# Altium project KOSVT.PrjPcb
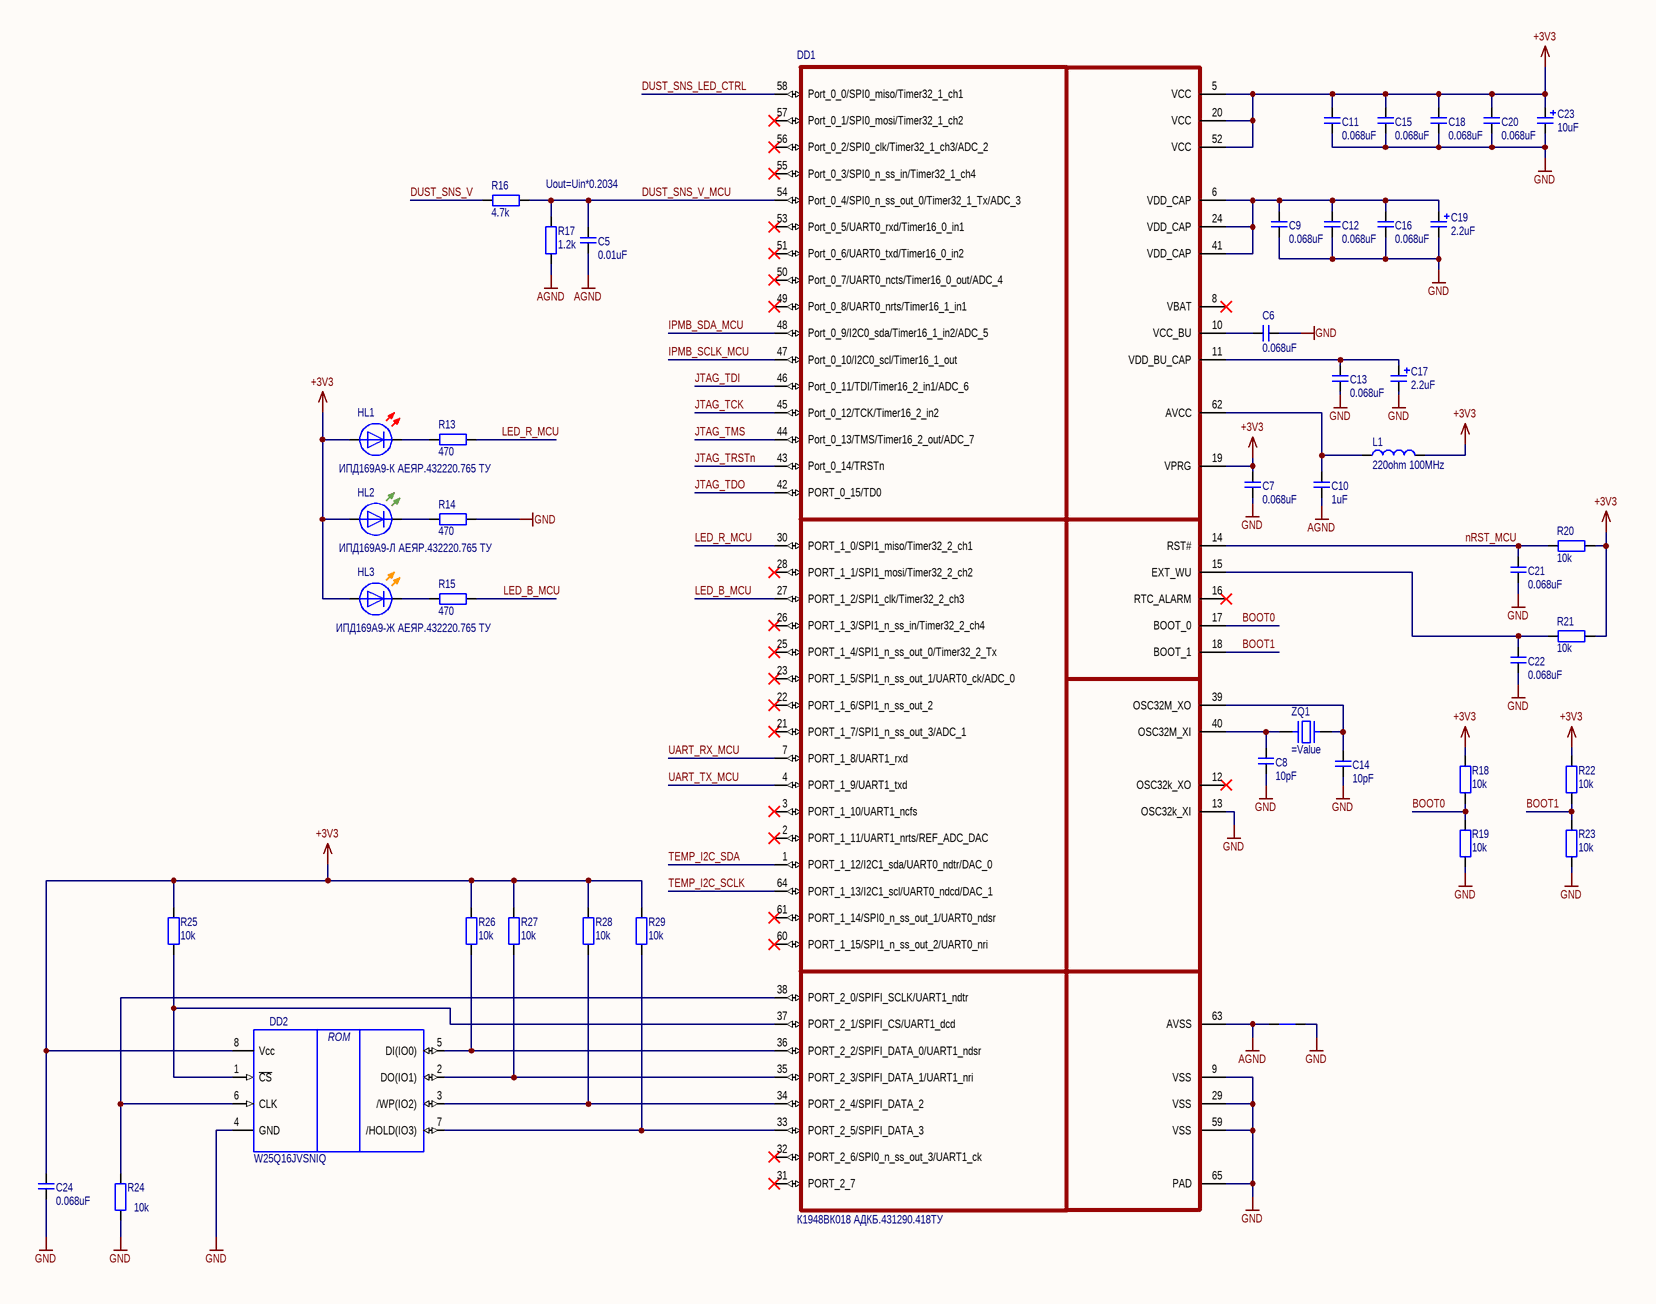
[diagram p0: MCU.SchDoc]
Major_version: 0; Minor_version: 1; Patch_version: 3; ProjectName: KOSVT-01; Вид_документа: Э3; Вид_документа_SCH: Схема электрическая принципиальная; Код_документа_SCH: Э3; Наименование: КОСВТ-01; Наименование1: КОСВТ-01; Наименование_PCB: КОСВТ-01; Обозначение: XXXX.468332.001; Обозначение_PCB: XXXX.468332.001Э3; Обозначение_Код: XXXX.468332.001Э3; Формат_PCB: А3
1 sheet, 45 parts. Net scope: global (net labels, ports and power ports of the same name join across sheets).
Board file: KOSVT-01.PcbDoc

## Sheet MCU.SchDoc
size 420 x 297 mm; Address1: Address1; Address2: Address2; Address3: Address3; Address4: Address4; SheetNumber: 2; SheetTotal: 2; Scale: 1:1; Обозначение документа: ВРГД.468332.001 Э3

### Parts
C5  0.01uF  [CAP 0603_1608]
C6  0.068uF  [CAP 0603_1608]
C7  0.068uF  [CAP 0603_1608]
C8  10pF  [CAP 0603_1608]
C9  0.068uF  [CAP 0603_1608]
C10  1uF  [CAP 1210_3225 - 1.8MM]
C11  0.068uF  [CAP 0603_1608]
C12  0.068uF  [CAP 0603_1608]
C13  0.068uF  [CAP 0603_1608]
C14  10pF  [CAP 0603_1608]
C15  0.068uF  [CAP 0603_1608]
C16  0.068uF  [CAP 0603_1608]
C17  2.2uF  [CAP ALSMD ELEC 4.3MM H5.4MM]
C18  0.068uF  [CAP 0603_1608]
C19  2.2uF  [CAP ALSMD ELEC 4.3MM H5.4MM]
C20  0.068uF  [CAP 0603_1608]
C21  0.068uF  [CAP 0603_1608]
C22  0.068uF  [CAP 0603_1608]
C23  10uF  [CAP ALSMD ELEC 4.3MM H5.4MM]
C24  0.068uF  [CAP 0603_1608]
DD1  К1948ВК018 АДКБ.431290.418ТУ  [QFN40P800X800X76_HS-65M]
DD2  W25Q16JVSNIQ  [WINBOND SOIC-8]
HL1  ИПД169А9-К АЕЯР.432220.765 ТУ  [LED 0603_1608 RED]
HL2  ИПД169А9-Л АЕЯР.432220.765 ТУ  [LED 0603_1608 GREEN]
HL3  ИПД169А9-Ж АЕЯР.432220.765 ТУ  [LED 0603_1608 YELLOW]
J1  (no value)  [NET_TIE_1MM]  (net tie, no BOM)
L1  220ohm 100MHz  [FER 0805_2012]
R13  470  [RES 0603_1608]
R14  470  [RES 0603_1608]
R15  470  [RES 0603_1608]
R16  4.7k  [RES 0603_1608]
R17  1.2k  [RES 0603_1608]
R18  10k  [RES 0603_1608]
R19  10k  [RES 0603_1608]
R20  10k  [RES 0603_1608]
R21  10k  [RES 0603_1608]
R22  10k  [RES 0603_1608]
R23  10k  [RES 0603_1608]
R24  10k  [RES 0603_1608]
R25  10k  [RES 0603_1608]
R26  10k  [RES 0603_1608]
R27  10k  [RES 0603_1608]
R28  10k  [RES 0603_1608]
R29  10k  [RES 0603_1608]
ZQ1  (no value)  [XTAL3225X07N]

### Nets
+3V3: C7.2 C11.2 C15.2 C18.2 C20.2 C23.1(P) C24.2 DD1.5(VCC) DD1.19(VPRG) DD1.20(VCC) DD1.52(VCC) DD2.8(Vcc) HL1.1(A) HL2.1(A) HL3.1(A) L1.2(N) R18.2 R20.1 R21.1 R22.2 R25.1 R26.2 R27.2 R28.2 R29.2
AGND: C5.2 C10.1 DD1.63(AVSS) J1.1(P) R17.1
GND: C6.1 C7.1 C8.1 C9.1 C11.1 C12.1 C13.1 C14.1 C15.1 C16.1 C17.2(N) C18.1 C19.2(N) C20.1 C21.1 C22.1 C23.2(N) C24.1 DD1.9(VSS) DD1.13(OSC32k_XI) DD1.29(VSS) DD1.59(VSS) DD1.65(PAD) DD2.4(GND) J1.2(N) R14.2 R19.1 R23.1 R24.1
BOOT0: DD1.17(BOOT_0) R18.1 R19.2
BOOT1: DD1.18(BOOT_1) R22.1 R23.2
DUST_SNS_LED_CTRL: DD1.58(Port_0_0/SPI0_miso/Timer32_1_ch1)
DUST_SNS_V: R16.1
DUST_SNS_V_MCU: C5.1 DD1.54(Port_0_4/SPI0_n_ss_out_0/Timer32_1_Tx/ADC_3) R16.2 R17.2
IPMB_SCLK_MCU: DD1.47(Port_0_10/I2C0_scl/Timer16_1_out)
IPMB_SDA_MCU: DD1.48(Port_0_9/I2C0_sda/Timer16_1_in2/ADC_5)
JTAG_TCK: DD1.45(Port_0_12/TCK/Timer16_2_in2)
JTAG_TDI: DD1.46(Port_0_11/TDI/Timer16_2_in1/ADC_6)
JTAG_TDO: DD1.42(PORT_0_15/TD0)
JTAG_TMS: DD1.44(Port_0_13/TMS/Timer16_2_out/ADC_7)
JTAG_TRSTn: DD1.43(Port_0_14/TRSTn)
LED_B_MCU: DD1.27(PORT_1_2/SPI1_clk/Timer32_2_ch3) R15.2
LED_R_MCU: DD1.30(PORT_1_0/SPI1_miso/Timer32_2_ch1) R13.2
nRST_MCU: C21.2 DD1.14(RST#) R20.2
TEMP_I2C_SCLK: DD1.64(PORT_1_13/I2C1_scl/UART0_ndcd/DAC_1)
TEMP_I2C_SDA: DD1.1(PORT_1_12/I2C1_sda/UART0_ndtr/DAC_0)
UART_RX_MCU: DD1.7(PORT_1_8/UART1_rxd)
UART_TX_MCU: DD1.4(PORT_1_9/UART1_txd)
NetC6_2: C6.2 DD1.10(VCC_BU)
NetC8_2: C8.2 DD1.40(OSC32M_XI) ZQ1.1
NetC9_2: C9.2 C12.2 C16.2 C19.1(P) DD1.6(VDD_CAP) DD1.24(VDD_CAP) DD1.41(VDD_CAP)
NetC10_2: C10.2 DD1.62(AVCC) L1.1(P)
NetC13_2: C13.2 C17.1(P) DD1.11(VDD_BU_CAP)
NetC14_2: C14.2 DD1.39(OSC32M_XO) ZQ1.3
NetC22_2: C22.2 DD1.15(EXT_WU) R21.2
NetDD1_33: DD1.33(PORT_2_5/SPIFI_DATA_3) DD2.7(/HOLD(IO3)) R29.1
NetDD1_34: DD1.34(PORT_2_4/SPIFI_DATA_2) DD2.3(/WP(IO2)) R28.1
NetDD1_35: DD1.35(PORT_2_3/SPIFI_DATA_1/UART1_nri) DD2.2(DO(IO1)) R27.1
NetDD1_36: DD1.36(PORT_2_2/SPIFI_DATA_0/UART1_ndsr) DD2.5(DI(IO0)) R26.1
NetDD1_37: DD1.37(PORT_2_1/SPIFI_CS/UART1_dcd) DD2.1(~{CS}) R25.2
NetDD1_38: DD1.38(PORT_2_0/SPIFI_SCLK/UART1_ndtr) DD2.6(CLK) R24.2
NetHL1_2: HL1.2(C) R13.1
NetHL2_2: HL2.2(C) R14.1
NetHL3_2: HL3.2(C) R15.1

Not connected (* = marked no-connect by the designer): DD1 2(PORT_1_11/UART1_nrts/REF_ADC_DAC)* 3(PORT_1_10/UART1_ncfs)* 8(VBAT)* 12(OSC32k_XO)* 16(RTC_ALARM)* 21(PORT_1_7/SPI1_n_ss_out_3/ADC_1)* 22(PORT_1_6/SPI1_n_ss_out_2)* 23(PORT_1_5/SPI1_n_ss_out_1/UART0_ck/ADC_0)* 25(PORT_1_4/SPI1_n_ss_out_0/Timer32_2_Tx)* 26(PORT_1_3/SPI1_n_ss_in/Timer32_2_ch4)* 28(PORT_1_1/SPI1_mosi/Timer32_2_ch2)* 31(PORT_2_7)* 32(PORT_2_6/SPI0_n_ss_out_3/UART1_ck)* 49(Port_0_8/UART0_nrts/Timer16_1_in1)* 50(Port_0_7/UART0_ncts/Timer16_0_out/ADC_4)* 51(Port_0_6/UART0_txd/Timer16_0_in2)* 53(Port_0_5/UART0_rxd/Timer16_0_in1)* 55(Port_0_3/SPI0_n_ss_in/Timer32_1_ch4)* 56(Port_0_2/SPI0_clk/Timer32_1_ch3/ADC_2)* 57(Port_0_1/SPI0_mosi/Timer32_1_ch2)* 60(PORT_1_15/SPI1_n_ss_out_2/UART0_nri)* 61(PORT_1_14/SPI0_n_ss_out_1/UART0_ndsr)*

### Notes on the sheet
- Uout=Uin*0.2034
- Подп. и дата
- Инв. № дубл.
- Взам. инв. №
- Инв. № подл.
- Изм.
- Лист
- № докум.
- Подп.
- Дата
- Копировал
- Формат А3
- (in symbol W25Q16JVSNIQ) ROM

### Library data of the parts
C5 = К10-83 - 50 В - 0,01 мкФ ±20 % - Н20 - N - 1 АЖЯР.673511.008 ТУ: Конденсатор К10-83 - 50 В - 0,01 мкФ ±20 % - Н20 - N - 1 АЖЯР.673511.008 ТУ; Manufacturer: АО «НИИ «Гириконд»; Group: Конденсаторы; Type: Конденсатор керамический; Tolerance: ± 20%; Voltage: 50V; Manufacturer Part Number: К10-83 - 50 В - 0,01 мкФ ±20 % - Н20 - N - 1 АЖЯР.673511.008 ТУ; Name: К10-83 - 50 В - 0,01 мкФ ±20 % - Н20 - N - 1 АЖЯР.673511.008 ТУ; Value: 0.01uF; Dielectric type: Н20; Country: Россия; Package: SMD0603; HelpURL: https://giricond.ru/upload/pdf/K/K10-83.pdf
C6 C7 C9 C11-C13 C15 C16 C18 C20-C22 = К10-83 - 10 В - 0,068 мкФ ±20 % - Н20 - N - 1 АЖЯР.673511.008 ТУ: Конденсатор К10-83 - 10 В - 0,068 мкФ ±20 % - Н20 - N - 1 АЖЯР.673511.008 ТУ; Manufacturer: АО «НИИ «Гириконд»; Group: Конденсаторы; Type: Конденсатор керамический; Tolerance: ± 20%; Voltage: 10V; Manufacturer Part Number: К10-83 - 10 В - 0,068 мкФ ±20 % - Н20 - N - 1 АЖЯР.673511.008 ТУ; Name: К10-83 - 10 В - 0,068 мкФ ±20 % - Н20 - N - 1 АЖЯР.673511.008 ТУ; Value: 0.068uF; Dielectric type: Н20; Country: Россия; Package: SMD0603; HelpURL: https://giricond.ru/upload/pdf/K/K10-83.pdf
C8 C14 = К10-83 - 50 В - 10 пФ ±10 % - МП0 - N - 1 АЖЯР.673511.008 ТУ: Конденсатор К10-83 - 50 В - 10 пФ ±10 % - МП0 - N - 1 АЖЯР.673511.008 ТУ; Manufacturer: АО «НИИ «Гириконд»; Group: Конденсаторы; Type: Конденсатор керамический; Tolerance: ± 10%; Voltage: 50V; Manufacturer Part Number: К10-83 - 50 В - 10 пФ ±10 % - МП0 - N - 1 АЖЯР.673511.008 ТУ; Name: К10-83 - 50 В - 10 пФ ±10 % - МП0 - N - 1 АЖЯР.673511.008 ТУ; Value: 10pF; Dielectric type: МП0; Country: Россия; Package: SMD0603; HelpURL: https://giricond.ru/upload/pdf/K/K10-83.pdf
C10 = К10-83 - 16 В - 1 мкФ ±20 % - Н20 - N - 1 АЖЯР.673511.008 ТУ: Конденсатор К10-83 - 16 В - 1 мкФ ±20 % - Н20 - N - 1 АЖЯР.673511.008 ТУ; Manufacturer: АО «НИИ «Гириконд»; Group: Конденсаторы; Type: Конденсатор керамический; Tolerance: ± 20%; Voltage: 16V; Manufacturer Part Number: К10-83 - 16 В - 1 мкФ ±20 % - Н20 - N - 1 АЖЯР.673511.008 ТУ; Name: К10-83 - 16 В - 1 мкФ ±20 % - Н20 - N - 1 АЖЯР.673511.008 ТУ; Value: 1uF; Dielectric type: Н20; Country: Россия; Package: SMD1210; HelpURL: https://giricond.ru/upload/pdf/K/K10-83.pdf
C17 C19 = К50-97 – 50В – 2,2мкФ (±20) % – ЕВАЯ.673541.054ТУ: Конденсатор К50-97 – 50В – 2,2мкФ (±20) % – ЕВАЯ.673541.054ТУ; Manufacturer: АО Элеконд; Group: Конденсаторы полярные; Type: Конденсатор электролитический; Tolerance: ± 20%; Dielectric type: Electrolytic; Voltage: 50V; Manufacturer Part Number: К50-97 – 50В – 2,2мкФ (±20) % – ЕВАЯ.673541.054ТУ; Name: К50-97 – 50В – 2,2мкФ (±20) % – ЕВАЯ.673541.054ТУ; Value: 2.2uF; Country: Россия; Package: SMD D4x5.4; HelpURL: https://elecond.ru/pdf/k50-97.pdf
C23 = К50-97 – 25В – 10мкФ (±20) % – ЕВАЯ.673541.054ТУ: Конденсатор К50-97 – 25В – 10мкФ (±20) % – ЕВАЯ.673541.054ТУ; Manufacturer: АО Элеконд; Group: Конденсаторы полярные; Type: Конденсатор электролитический; Tolerance: ± 20%; Dielectric type: Electrolytic; Voltage: 25V; Manufacturer Part Number: К50-97 – 25В – 10мкФ (±20) % – ЕВАЯ.673541.054ТУ; Name: К50-97 – 25В – 10мкФ (±20) % – ЕВАЯ.673541.054ТУ; Value: 10uF; Country: Россия; Package: SMD D4x5.4; HelpURL: https://elecond.ru/pdf/k50-97.pdf
C24 = К10-83 - 10 В - 0,068 мкФ ±20 % - Н20 АЖЯР.673511.008 ТУ: Конденсатор К10-83 - 10 В - 0,068 мкФ ±20 % - Н20 АЖЯР.673511.008 ТУ; Manufacturer: АО «НИИ «Гириконд»; Group: Конденсаторы; Type: Конденсатор керамический; Tolerance: ± 20%; Voltage: 10V; Manufacturer Part Number: К10-83 - 10 В - 0,068 мкФ ±20 % - Н20 АЖЯР.673511.008 ТУ; Name: К10-83 - 10 В - 0,068 мкФ ±20 % - Н20 АЖЯР.673511.008 ТУ; Value: 0.068uF; Dielectric type: Н20; Country: Россия; Package: SMD0603; HelpURL: https://giricond.ru/upload/pdf/K/K10-83.pdf
DD1 = К1948ВК018 АДКБ.431290.418ТУ: Микроконтроллер К1948ВК018 АДКБ.431290.418ТУ; Manufacturer: АО «МИКРОН»; Group: Микросхемы; Supply Voltage: 3,3V; Max Temperature: 85°С; Min Temperature: -45°С; Manufacturer Part Number: К1948ВК018 АДКБ.431290.418ТУ; Type: Микроконтроллер; Package: QFN40; HelpURL: https://mikron.ru/upload/docs/mcu/Information_AMUR_MIK32.pdf; Name: К1948ВК018 АДКБ.431290.418ТУ; Country: Россия
DD2 = W25Q16JVSNIQ: Память Flash W25Q16JVSNIQ; Manufacturer: Winbond; Group: Микросхемы; Supply Voltage: 3,3V; Max Temperature: 85°С; Min Temperature: -40°С; Notes: 16Mb(2M x 8); Manufacturer Part Number: W25Q16JVSNIQ; Type: Память Flash; Name: W25Q16JVSNIQ; Country: Тайвань; Package: SOIC-8; HelpURL: https://static.chipdip.ru/lib/136/DOC012136857.pdf
HL1 = ИПД169А9-К АЕЯР.432220.765 ТУ: Индикатор ИПД169А9-К АЕЯР.432220.765 ТУ; Manufacturer: АО «Протон»; Group: Светодиоды; Type: Светодиод; Max If: 20mA; Manufacturer Part Number: ИПД169А9-К АЕЯР.432220.765 ТУ; Name: Индикатор ИПД169А9-К АЕЯР.432220.765 ТУ; Country: Россия; Package: SMD1608
HL2 = ИПД169А9-Л АЕЯР.432220.765 ТУ: Индикатор ИПД169А9-Л АЕЯР.432220.765 ТУ; Manufacturer: АО «Протон»; Group: Светодиоды; Type: Светодиод; Max If: 20mA; Manufacturer Part Number: ИПД169А9-Л АЕЯР.432220.765 ТУ; Name: Индикатор ИПД169А9-Л АЕЯР.432220.765 ТУ; Country: Россия; Package: SMD1608
HL3 = ИПД169А9-Ж АЕЯР.432220.765 ТУ: Индикатор ИПД169А9-Ж АЕЯР.432220.765 ТУ; Manufacturer: АО «Протон»; Group: Светодиоды; Type: Светодиод; Max If: 20mA; Manufacturer Part Number: ИПД169А9-Ж АЕЯР.432220.765 ТУ; Name: Индикатор ИПД169А9-Ж АЕЯР.432220.765 ТУ; Country: Россия; Package: SMD1608
J1 = NET_TIE_1MM: Перемычка SMD NET_TIE_1MM; Group: Перемычки; Manufacturer Part Number: NET_TIE_1MM; Type: Перемычка SMD; Name: NET_TIE_1MM
L1 = BLM21PG221SN1D: Индуктивность ЭМП 0805-2A-220Ом ± 25% 100MHz; Manufacturer: Murata Electronics; Group: Индуктивности; Type: Дроссель ЭМП; Current: 2000mA; Rdc: 0.05Ohm; Manufacturer Part Number: BLM21PG221SN1D; Name: BLM21PG221SN1D; Value: 220ohm 100MHz; Tolerance: ±25%; Country: Япония; Package: SMD0805; HelpURL: https://static.chipdip.ru/lib/250/DOC000250690.pdf
R13-R15 = Резистор Р1-12 - 0,1 - 470Ом - ±1 % - У - "А" АЛЯР.434110.005 ТУ: Manufacturer: АО «НПО «ЭРКОН»; Group: Резисторы; Tolerance: ± 1%; Power: 0.1W; Voltage: 50V; Manufacturer Part Number: Резистор Р1-12 - 0,1 - 470Ом - ±1 % - У - "А" АЛЯР.434110.005 ТУ; Type: Резистор; Name: Резистор Р1-12 - 0,1 - 470Ом - ±1 % - У - "А" АЛЯР.434110.005 ТУ; Value: 470; Country: Россия; Package: SMD0603; HelpURL: https://www.erkon-nn.ru/upload/model_library/R1-12/r1-12_5.pdf
R16 = Резистор Р1-12 - 0,1 - 4,7кОм - ±1 % - У - "А" АЛЯР.434110.005 ТУ: Manufacturer: АО «НПО «ЭРКОН»; Group: Резисторы; Tolerance: ± 1%; Power: 0.1W; Voltage: 50V; Manufacturer Part Number: Резистор Р1-12 - 0,1 - 4,7кОм - ±1 % - У - "А" АЛЯР.434110.005 ТУ; Type: Резистор; Name: Резистор Р1-12 - 0,1 - 4,7кОм - ±1 % - У - "А" АЛЯР.434110.005 ТУ; Value: 4.7k; Country: Россия; Package: SMD0603; HelpURL: https://www.erkon-nn.ru/upload/model_library/R1-12/r1-12_5.pdf
R17 = Резистор Р1-12 - 0,1 - 1,2кОм - ±1 % - У - "А" АЛЯР.434110.005 ТУ: Manufacturer: АО «НПО «ЭРКОН»; Group: Резисторы; Tolerance: ± 1%; Power: 0.1W; Voltage: 50V; Manufacturer Part Number: Резистор Р1-12 - 0,1 - 1,2кОм - ±1 % - У - "А" АЛЯР.434110.005 ТУ; Type: Резистор; Name: Резистор Р1-12 - 0,1 - 1,2кОм - ±1 % - У - "А" АЛЯР.434110.005 ТУ; Value: 1.2k; Country: Россия; Package: SMD0603; HelpURL: https://www.erkon-nn.ru/upload/model_library/R1-12/r1-12_5.pdf
R18-R29 = Резистор Р1-12 - 0,1 - 10кОм - ±1 % - У - "А" АЛЯР.434110.005 ТУ: Manufacturer: АО «НПО «ЭРКОН»; Group: Резисторы; Tolerance: ± 1%; Power: 0.1W; Voltage: 50V; Manufacturer Part Number: Резистор Р1-12 - 0,1 - 10кОм - ±1 % - У - "А" АЛЯР.434110.005 ТУ; Type: Резистор; Name: Резистор Р1-12 - 0,1 - 10кОм - ±1 % - У - "А" АЛЯР.434110.005 ТУ; Value: 10k; Country: Россия; Package: SMD0603; HelpURL: https://www.erkon-nn.ru/upload/model_library/R1-12/r1-12_5.pdf
ZQ1 = РК1009-7ВП-32000К-В  (10 пФ) КЖБД.433514.031 ТУ: Резонатор кварцевый РК1009-7ВП-32000К-В  (10 пФ) КЖБД.433514.031 ТУ; Manufacturer: АО Пьезо; Value: 32MHz; Group: Кварцы; Tolerance: ±20 ppm; Load Capacity: 10pF; ESR: 60Ohm; Manufacturer Part Number: РК1009-7ВП-32000К-В  (10 пФ) КЖБД.433514.031 ТУ; Type: Кварцевый резонатор; Name: РК1009-7ВП-32000К-В  (10 пФ) КЖБД.433514.031 ТУ; Freq: 32MHz; Country: Россия; Package: SMD32x25x07; HelpURL: https://www.oaopiezo.com/assets/files/quartz/rk1009-SMD3225.pdf

## Assembly variants
IPMB_3V3: not fitted R4 R6 R18 R23 VT1 VT2
IPMB_5V: not fitted R2 R5 R18 R23